# EAGLE design Adafruit NeoPixel Ring 12 rev B (EAGLE 9.6.2)
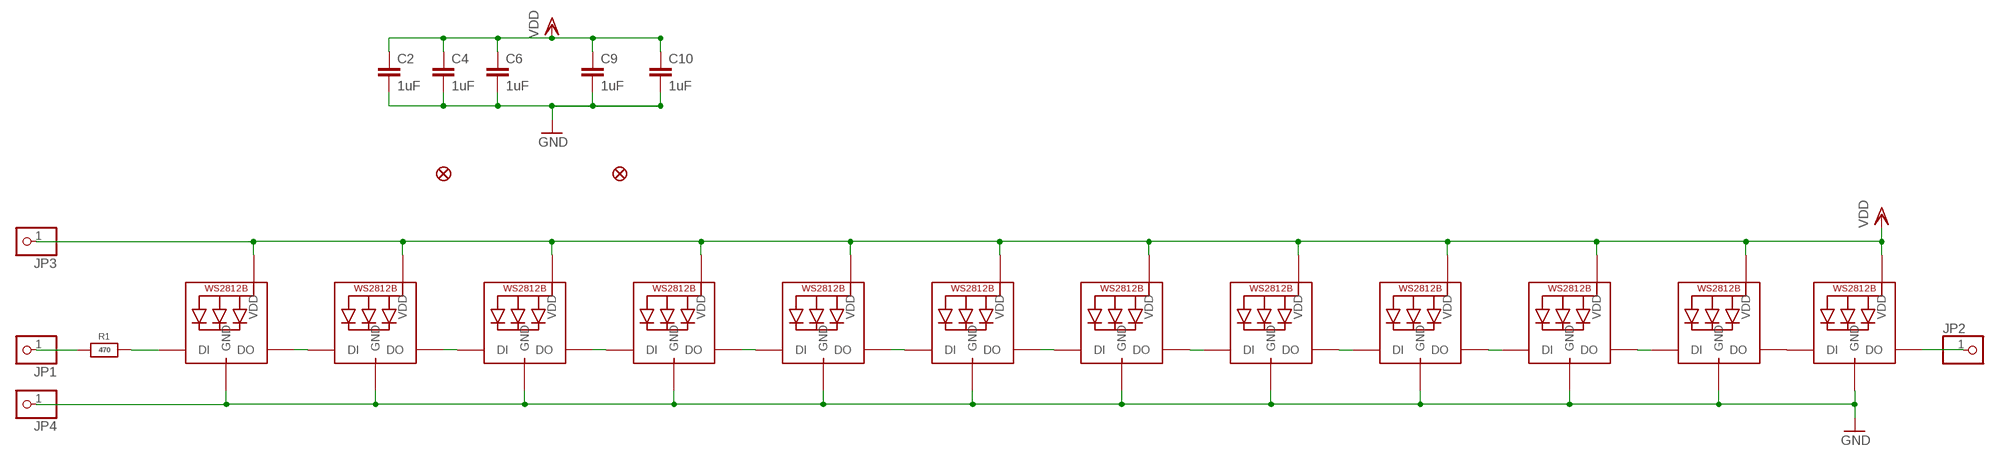
[diagram p0: schematic, sheet 1]

## Parts
C2  1uF  C-EUC0603  [C0603]
C4  1uF  C-EUC0603  [C0603]
C6  1uF  C-EUC0603  [C0603]
C9  1uF  C-EUC0603  [C0603]
C10  1uF  C-EUC0603  [C0603]
FID1  FIDUCIAL_1MM  [FIDUCIAL_1MM]
FID2  FIDUCIAL_1MM  [FIDUCIAL_1MM]
JP1  PINHD-1X1CB  [1X01-CLEANBIG]
JP2  PINHD-1X1CB  [1X01-CLEANBIG]
JP3  PINHD-1X1CB  [1X01-CLEANBIG]
JP4  PINHD-1X1CB  [1X01-CLEANBIG]
LED1  WS2812B_5050N  [WS2812B-NARROW]
LED2  WS2812B_5050N  [WS2812B-NARROW]
LED3  WS2812B_5050N  [WS2812B-NARROW]
LED4  WS2812B_5050N  [WS2812B-NARROW]
LED5  WS2812B_5050N  [WS2812B-NARROW]
LED6  WS2812B_5050N  [WS2812B-NARROW]
LED7  WS2812B_5050N  [WS2812B-NARROW]
LED8  WS2812B_5050N  [WS2812B-NARROW]
LED9  WS2812B_5050N  [WS2812B-NARROW]
LED10  WS2812B_5050N  [WS2812B-NARROW]
LED11  WS2812B_5050N  [WS2812B-NARROW]
LED12  WS2812B_5050N  [WS2812B-NARROW]
R1  470  RESISTOR_0603_NOOUT  [0603-NO]

## Nets
GND: C2.2 C4.2 C6.2 C9.2 C10.2 JP4.1 LED1.3-GND(GND) LED2.3-GND(GND) LED3.3-GND(GND) LED4.3-GND(GND) LED5.3-GND(GND) LED6.3-GND(GND) LED7.3-GND(GND) LED8.3-GND(GND) LED9.3-GND(GND) LED10.3-GND(GND) LED11.3-GND(GND) LED12.3-GND(GND)
N$1: LED1.2-DOUT(DO) LED2.4-DIN(DI)
N$2: LED2.2-DOUT(DO) LED3.4-DIN(DI)
N$3: LED3.2-DOUT(DO) LED4.4-DIN(DI)
N$4: LED4.2-DOUT(DO) LED5.4-DIN(DI)
N$5: LED5.2-DOUT(DO) LED6.4-DIN(DI)
N$6: LED6.2-DOUT(DO) LED7.4-DIN(DI)
N$7: LED7.2-DOUT(DO) LED8.4-DIN(DI)
N$8: LED8.2-DOUT(DO) LED9.4-DIN(DI)
N$9: LED9.2-DOUT(DO) LED10.4-DIN(DI)
N$10: LED10.2-DOUT(DO) LED11.4-DIN(DI)
N$11: LED11.2-DOUT(DO) LED12.4-DIN(DI)
N$12: LED1.4-DIN(DI) R1.2
N$13: JP1.1 R1.1
N$14: JP2.1 LED12.2-DOUT(DO)
VDD: C2.1 C4.1 C6.1 C9.1 C10.1 JP3.1 LED1.1-VDD(VDD) LED2.1-VDD(VDD) LED3.1-VDD(VDD) LED4.1-VDD(VDD) LED5.1-VDD(VDD) LED6.1-VDD(VDD) LED7.1-VDD(VDD) LED8.1-VDD(VDD) LED9.1-VDD(VDD) LED10.1-VDD(VDD) LED11.1-VDD(VDD) LED12.1-VDD(VDD)

## Library data of the parts
C2 C4 C6 C9 C10 = rcl:C-EU: CAPACITOR, European symbol; SPICEPREFIX: C
FID1 FID2 = microbuilder:FIDUCIAL: Fiducial Alignment Points Various fiducial points for machine vision alignment.; BOM: EXCLUDE
JP1-JP4 = NeoPixelRing:PINHD-1X1: Pin header 1x1 for 0.1" spacing With round pins
LED1-LED12 = microbuilder:WS2812B
R1 = microbuilder:RESISTOR: Resistors For new designs, use the packages preceded by an '_' character since they are more reliable: The following footprints should be used on most boards: _0402 - Standard footprint for regular board layouts _0603 - Standard footprint for regular board layouts _0805 - Standard footprint for regular board layouts _1206 - Standard footprint for regular board layouts For extremely tight-pitch boards where space is at a premium, the following 'micro-pitch' footprints can be used (smaller pads, no silkscreen outline, etc.): _0402MP - Micro-pitch footprint for very dense/compact boards _0603MP - Micro-pitch footprint for very dense/compact boards _0805MP - Micro-pitch footprint for very dense/compact boards _1206MP - Micro-pitch footprint for very dense/compact boards

## Board
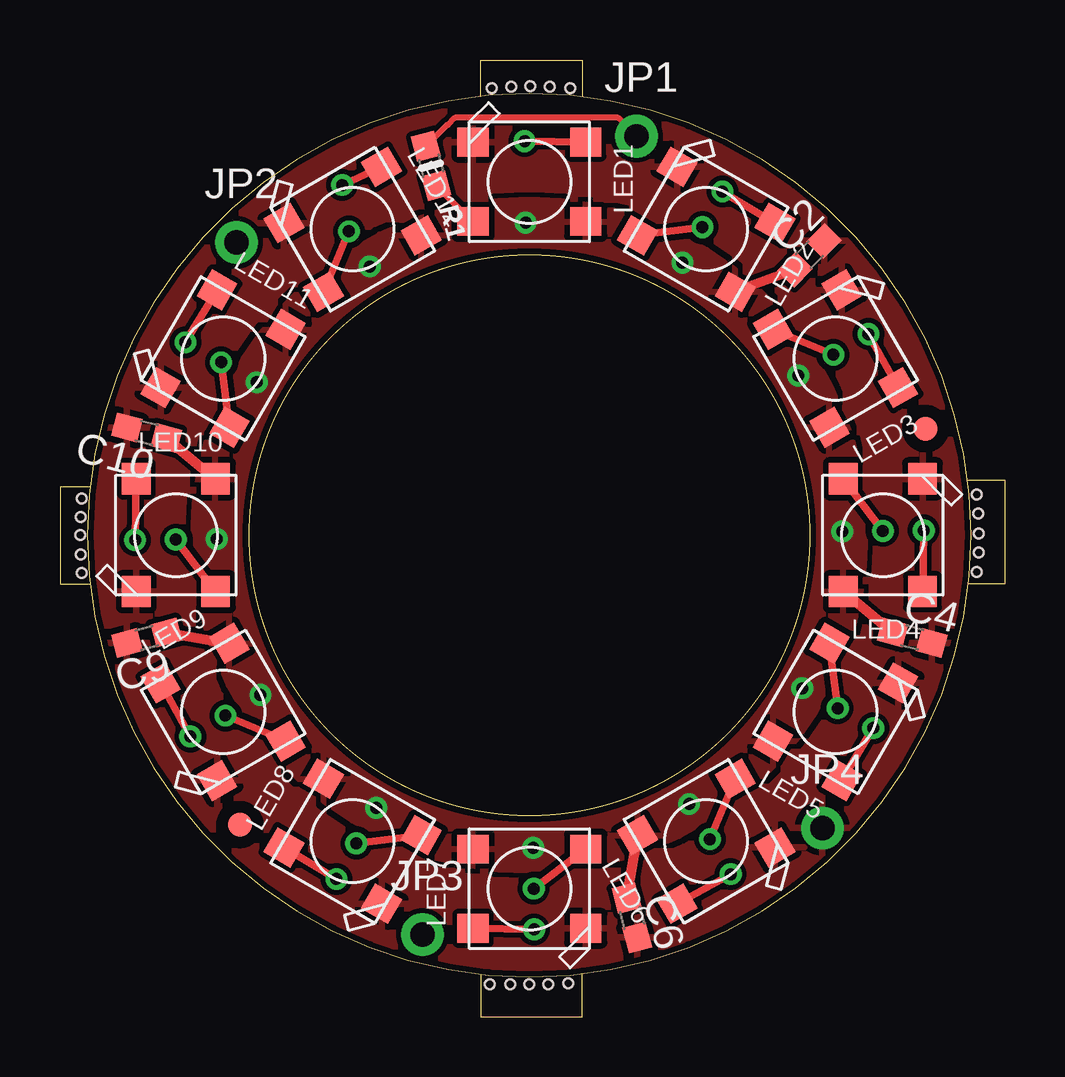
[diagram p1: board, top side]
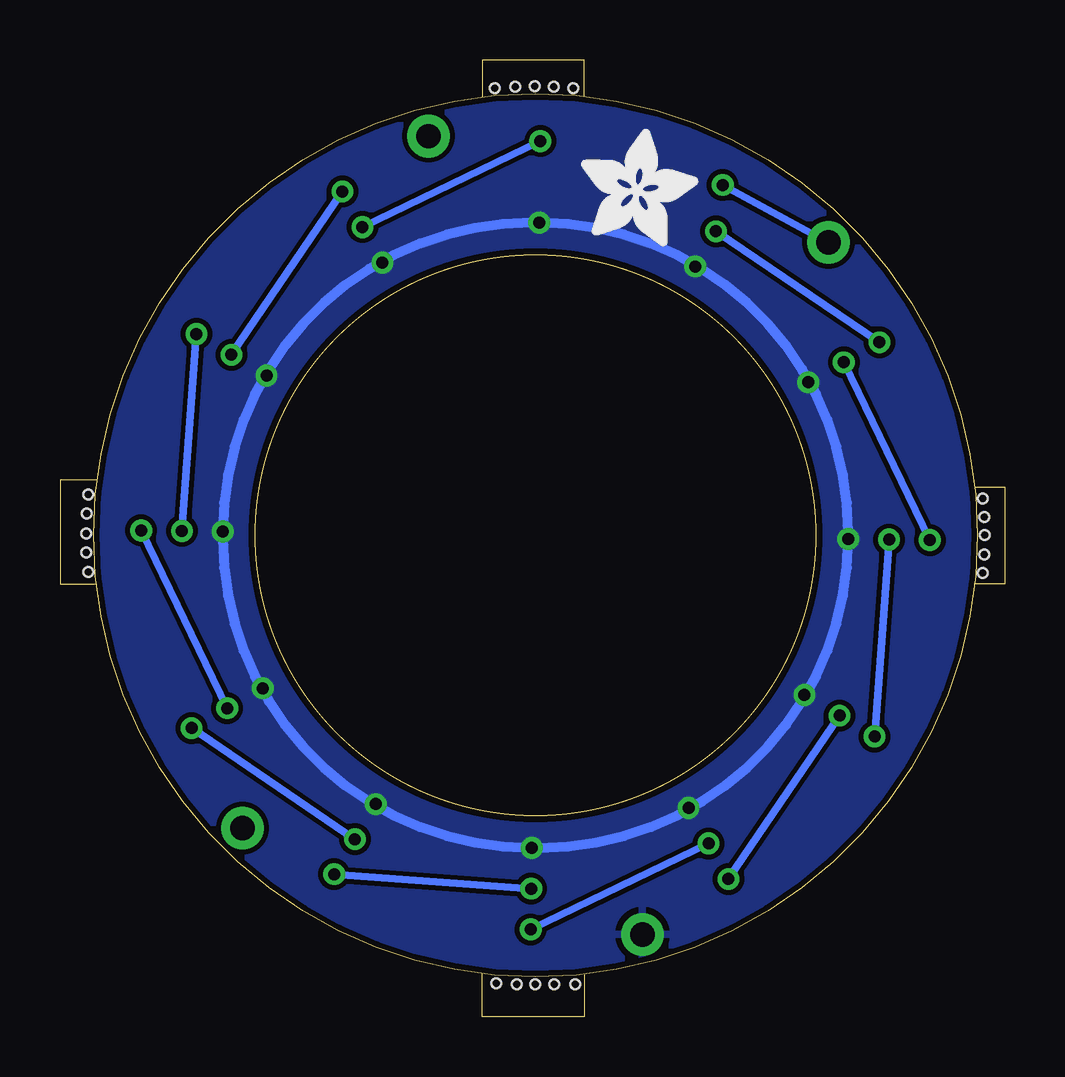
[diagram p2: board, bottom side, seen from below]

Size 39.37 x 39.88 mm. Coordinates in mm from the lower left corner, seen from the top.
Outline: 17.53,38.35 17.53,39.88 21.77,39.88 21.77,38.35
Outline: 37.82,22.38 39.37,22.38 39.37,18.03 37.85,18.03
Outline: 17.53,1.75 17.53,0 21.77,0 21.77,1.8
Outline: 1.25,22.07 0,22.07 0,18.03 1.27,18.03
Outline: 1.14,20.07 arc90 19.56,1.65 arc90 37.97,20.07 arc90 19.56,38.48 arc90 1.14,20.07
Outline: circle at 19.56,20.07 radius 11.68
Copper layers (1*16): Top 0.035mm / dielectric 1.5mm / Bottom 0.035mm
Design rules "adafruit": minimum track width 8mil, minimum drill 15.5mil, track to track 8mil, track to pad 8mil, pad to pad 8mil, via to via 8mil, smd to smd 8mil, copper to edge 10mil, drill to drill 8mil, minimum pad ring 10mil, minimum via ring 8mil, stop-mask expansion 4mil, vias tented up to drill 20mil, thermal gap 10mil
Holes 0.4 mm at 19.58,38.79 18.8,38.76 17.98,38.71 20.4,38.76 21.26,38.71 38.28,20.14 38.25,20.98 38.2,21.77 38.28,19.35 38.2,18.54 19.56,1.35 18.77,1.35 17.91,1.35 20.35,1.35 21.18,1.4 0.84,20.07 0.86,20.83 0.91,21.59 0.86,19.25 0.91,18.49

### Footprints (pad centres in the part's own frame; a part is rotated, then mirrored left to right if it is on the bottom)
C0603 = smd 1.1 x 1: 1 -0.85,0; 2 0.85,0
FIDUCIAL_1MM = smd 1 x 1: 1 0,0
1X01-CLEANBIG = drill 1.016 pad 1.778: 1 0,0
WS2812B-NARROW = smd 1.3 x 1.2: 1-VDD 2.35,-1.65; 2-DOUT 2.35,1.65; 3-GND -2.35,1.65; 4-DIN -2.35,-1.65
0603-NO = smd 1.075 x 1: 1 -0.85,0; 2 0.85,0

### Placement (x,y rotation side)
C2  31.23,31.74 45 top
C4  35.51,15.79 345 top
C6  23.83,4.12 285 top
C9  3.61,15.79 195 top
C10  3.61,24.34 165 top
FID1  36.07,24.51 0 top
FID2  7.49,8 0 top
JP1  24.02,36.7 0 top
JP2  7.35,32.27 0 top
JP3  15.1,3.42 0 top
JP4  31.77,7.86 0 top
LED1  19.56,34.8 0 top
LED2  26.92,32.82 330 top
LED3  32.32,27.43 300 top
LED4  34.29,20.07 270 top
LED5  32.32,12.7 240 top
LED6  26.92,7.31 210 top
LED7  19.56,5.33 180 top
LED8  12.19,7.31 150 top
LED9  6.8,12.7 120 top
LED10  4.83,20.07 90 top
LED11  6.8,27.43 60 top
LED12  12.19,32.82 30 top
PLABEL0  [PLABEL0]  23.8,34.14 75 top
PLABEL1  [PLABEL1]  7.7,31.15 315 top
PLABEL2  [PLABEL2]  31.41,8.87 135 top
PLABEL3  [PLABEL3]  15.85,4.16 75 top
PLABEL4  [PLABEL4]  25.4,32.33 0 bottom
PLABEL5  [PLABEL5]  9.25,27.74 0 bottom
PLABEL6  [PLABEL6]  32.18,9.88 0 bottom
PLABEL7  [PLABEL7]  18.5,4.6 0 bottom
PLABEL8  [PLABEL8]  32.49,17.2 90 bottom
R1  15.46,35.47 285 top
U$3  [ADAFRUIT_5MM]  17.65,32.13 0 bottom

### Tracks (layer width: path | path; a pad name or v marks a point on that pad's centre or on a via)
GND
  pour Top (rank 2): 0.51,39.12 38.61,39.12 38.61,1.02 0.51,1.02
N$1  (via drill 0.5)
  Top 0.305: LED1.2-DOUT v19.36,36.5 | LED2.4-DIN v26.77,32.91
  Bottom 0.305: v19.36,36.5 v26.77,32.91
N$2  (via drill 0.5)
  Top 0.305: LED2.2-DOUT v27.6,34.4 | LED3.4-DIN v32.23,27.59
  Bottom 0.305: v27.6,34.4 v32.23,27.59
N$3  (via drill 0.5)
  Top 0.305: LED3.2-DOUT v33.69,28.45 | LED4.4-DIN v34.29,20.25
  Bottom 0.305: v33.69,28.45 v34.29,20.25
N$4  (via drill 0.5)
  Top 0.305: LED4.2-DOUT v35.99,20.27 | v32.41,12.86 LED5.4-DIN
  Bottom 0.305: v35.99,20.27 v32.41,12.86
N$5  (via drill 0.5)
  Top 0.305: LED5.2-DOUT v33.89,12.02 | v27.08,7.4 LED6.4-DIN
  Bottom 0.305: v33.89,12.02 v27.08,7.4
N$6  (via drill 0.5)
  Top 0.305: LED6.2-DOUT v27.95,5.94 | LED7.4-DIN v19.74,5.33
  Bottom 0.305: v27.95,5.94 v19.74,5.33
N$7  (via drill 0.5)
  Top 0.305: LED8.4-DIN v12.35,7.22 | LED7.2-DOUT v19.76,3.63
  Bottom 0.305: v19.76,3.63 v12.35,7.22
N$8  (via drill 0.5)
  Top 0.305: LED9.4-DIN v6.89,12.54 | LED8.2-DOUT v11.52,5.74
  Bottom 0.305: v11.52,5.74 v6.89,12.54
N$9  (via drill 0.5)
  Top 0.305: LED9.2-DOUT v5.43,11.68 | LED10.4-DIN v4.83,19.89
  Bottom 0.305: v5.43,11.68 v4.83,19.89
N$10  (via drill 0.5)
  Top 0.305: LED11.4-DIN v6.71,27.28 | v3.13,19.86 LED10.2-DOUT
  Bottom 0.305: v3.13,19.86 v6.71,27.28
N$11  (via drill 0.5)
  Top 0.305: LED11.2-DOUT v5.23,28.11 | LED12.4-DIN v12.04,32.73
  Bottom 0.305: v5.23,28.11 v12.04,32.73
N$12
  Top 0.254: R1.2 17.18,33.15 LED1.4-DIN
N$13
  Top 0.254: JP1.1 23.25,37.47 16.46,37.47 16.16,37.17 16.12,37.17 R1.1 15.24,36.55
N$14  (via drill 0.5)
  Top 0.305: LED12.2-DOUT v11.76,34.67
  Bottom 0.305: v11.76,34.67 JP2.1
VDD  (via drill 0.5)
  Top 0.406: C10.1 LED10.1-VDD | C2.1 LED2.1-VDD | C4.1 LED4.1-VDD | C6.1 LED6.1-VDD | C9.1 LED9.1-VDD
  Bottom 0.406: v19.72,7.03 19.4,7.03 arc-90 v6.53,19.91 6.53,20.22 arc-90 v19.4,33.1 19.72,33.1 arc-90 v32.59,20.22 32.59,19.9 arc-90 v19.72,7.03
  other vias: 25.94,31.43 30.76,26.72 30.92,13.69 26.21,8.86 13.18,8.7 8.35,13.41 8.19,26.44 12.9,31.27
  pour Bottom (rank 2): 0.51,39.12 38.61,39.12 38.61,1.02 0.51,1.02
  pour Top (isolate 0.254): 5.56,20.07 arc-90 19.56,34.07 arc-90 33.56,20.07 arc-90 19.56,6.07 arc-90

### Text on the board
Pinguin_tBackup: IN | OUT | GND | PWR
Pinguin_bBackup: Data / Input | Data / Out | NeoPixel / Ring x12 | GND | 5V DC / Power